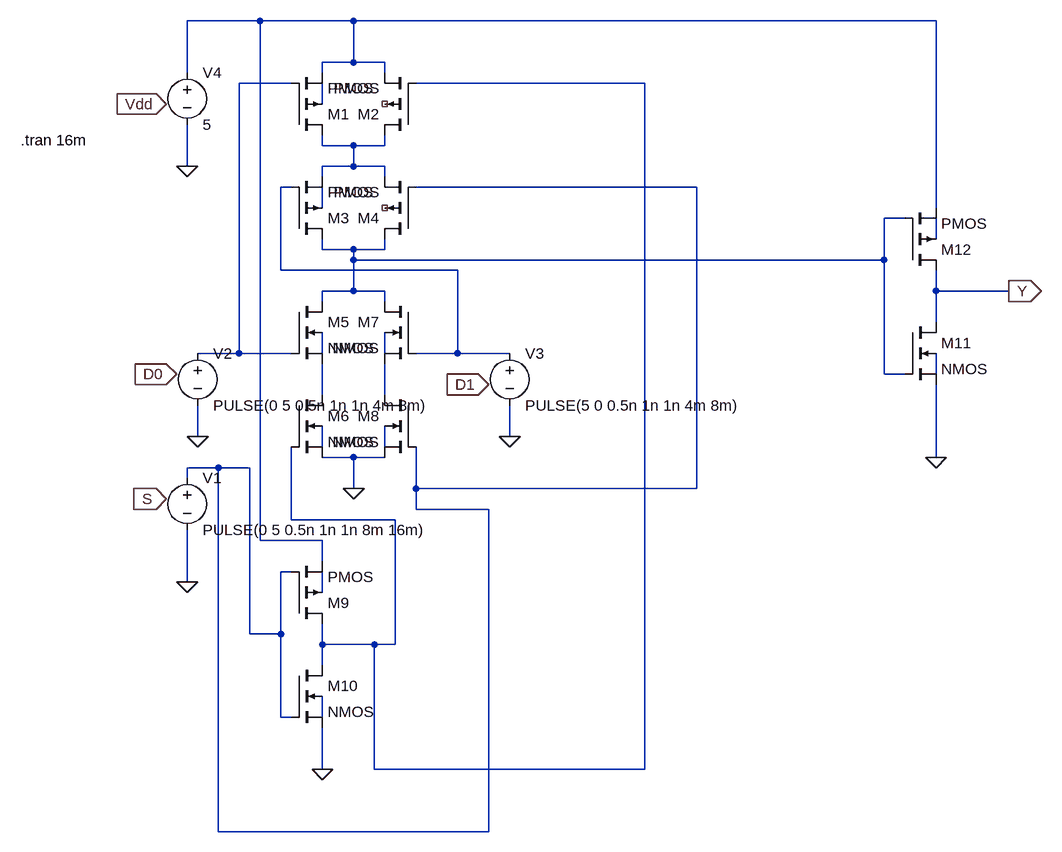
[diagram p0: schematic mux.asc]
mux.asc, the LTspice schematic file:
Version 4.1
SHEET 1 1260 1220
WIRE 32 -32 -80 -32
WIRE 176 -32 32 -32
WIRE 1072 -32 176 -32
WIRE 176 32 176 -32
WIRE 176 32 128 32
WIRE 224 32 176 32
WIRE -80 48 -80 -32
WIRE 128 48 128 32
WIRE 224 48 224 32
WIRE 80 64 0 64
WIRE 624 64 272 64
WIRE 128 96 128 64
WIRE 128 160 128 144
WIRE 176 160 128 160
WIRE 224 160 224 144
WIRE 224 160 176 160
WIRE -80 192 -80 128
WIRE 176 192 176 160
WIRE 176 192 128 192
WIRE 224 192 176 192
WIRE 128 208 128 192
WIRE 224 208 224 192
WIRE 80 224 64 224
WIRE 704 224 272 224
WIRE 128 256 128 224
WIRE 1072 256 1072 -32
WIRE 1024 272 992 272
WIRE 1072 304 1072 272
WIRE 128 320 128 304
WIRE 176 320 128 320
WIRE 224 320 224 304
WIRE 224 320 176 320
WIRE 176 336 176 320
WIRE 992 336 992 272
WIRE 992 336 176 336
WIRE 64 352 64 224
WIRE 336 352 64 352
WIRE 176 384 176 336
WIRE 176 384 128 384
WIRE 224 384 176 384
WIRE 1072 384 1072 352
WIRE 1184 384 1072 384
WIRE 128 400 128 384
WIRE 224 400 224 384
WIRE 1072 432 1072 384
WIRE 0 480 0 64
WIRE 0 480 -64 480
WIRE 80 480 0 480
WIRE 128 480 128 448
WIRE 224 480 224 448
WIRE 336 480 336 352
WIRE 336 480 272 480
WIRE 416 480 336 480
WIRE 992 512 992 336
WIRE 1024 512 992 512
WIRE 1072 512 1072 480
WIRE 128 544 128 496
WIRE 224 544 224 496
WIRE -64 608 -64 560
WIRE 416 608 416 560
WIRE 128 624 128 592
WIRE 224 624 224 592
WIRE 176 640 128 640
WIRE 224 640 176 640
WIRE 1072 640 1072 528
WIRE -32 656 -80 656
WIRE 16 656 -32 656
WIRE -80 672 -80 656
WIRE 176 688 176 640
WIRE 272 688 272 624
WIRE 704 688 704 224
WIRE 704 688 272 688
WIRE 272 720 272 688
WIRE 384 720 272 720
WIRE 80 736 80 624
WIRE 240 736 80 736
WIRE 32 768 32 -32
WIRE 128 768 32 768
WIRE 128 800 128 768
WIRE 80 816 64 816
WIRE -80 832 -80 752
WIRE 128 848 128 816
WIRE 16 912 16 656
WIRE 64 912 64 816
WIRE 64 912 16 912
WIRE 128 928 128 896
WIRE 208 928 128 928
WIRE 240 928 240 736
WIRE 240 928 208 928
WIRE 128 960 128 928
WIRE 64 1040 64 912
WIRE 80 1040 64 1040
WIRE 128 1040 128 1008
WIRE 128 1120 128 1056
WIRE 208 1120 208 928
WIRE 624 1120 624 64
WIRE 624 1120 208 1120
WIRE -32 1216 -32 656
WIRE 384 1216 384 720
WIRE 384 1216 -32 1216
FLAG 1072 640 0
FLAG 128 1120 0
FLAG -80 192 0
FLAG -64 608 0
FLAG 416 608 0
FLAG -80 832 0
FLAG 176 688 0
FLAG -112 704 S
IOPIN -112 704 In
FLAG -96 512 D0
IOPIN -96 512 In
FLAG 384 528 D1
IOPIN 384 528 In
FLAG 1184 384 Y
IOPIN 1184 384 Out
FLAG -112 96 Vdd
IOPIN -112 96 In
SYMBOL pmos4 80 144 M180
SYMATTR InstName M1
SYMBOL pmos4 272 144 R180
SYMATTR InstName M2
SYMBOL pmos4 80 304 M180
SYMATTR InstName M3
SYMBOL pmos4 272 304 R180
SYMATTR InstName M4
SYMBOL nmos4 80 400 R0
SYMATTR InstName M5
SYMBOL nmos4 80 544 R0
SYMATTR InstName M6
SYMBOL nmos4 272 400 M0
SYMATTR InstName M7
SYMBOL nmos4 272 544 M0
SYMATTR InstName M8
SYMBOL voltage -80 656 R0
WINDOW 123 0 0 Left 0
WINDOW 39 0 0 Left 0
SYMATTR InstName V1
SYMATTR Value PULSE(0 5 0.5n 1n 1n 8m 16m)
SYMBOL voltage -64 464 R0
WINDOW 123 0 0 Left 0
WINDOW 39 0 0 Left 0
SYMATTR InstName V2
SYMATTR Value PULSE(0 5 0.5n 1n 1n 4m 8m)
SYMBOL voltage 416 464 R0
WINDOW 123 0 0 Left 0
WINDOW 39 0 0 Left 0
SYMATTR InstName V3
SYMATTR Value PULSE(5 0 0.5n 1n 1n 4m 8m)
SYMBOL voltage -80 32 R0
WINDOW 123 0 0 Left 0
WINDOW 39 0 0 Left 0
SYMATTR InstName V4
SYMATTR Value 5
SYMBOL pmos4 80 896 M180
SYMATTR InstName M9
SYMBOL nmos4 80 960 R0
SYMATTR InstName M10
SYMBOL nmos4 1024 432 R0
SYMATTR InstName M11
SYMBOL pmos4 1024 352 M180
SYMATTR InstName M12
TEXT -336 152 Left 2 !.tran 16m

The netlist it stands for:
* mux.asc
M1 N005 N002 N001 N004 PMOS
M2 N005 N003 N001 NC_01 PMOS
M3 N009 N006 N005 N008 PMOS
M4 N009 N007 N005 NC_02 PMOS
M5 N009 N002 N014 N011 NMOS
M6 N014 N003 0 N016 NMOS
M7 N009 N006 N015 N012 NMOS
M8 N015 N007 0 N017 NMOS
V1 N007 0 PULSE(0 5 0.5n 1n 1n 8m 16m)
V2 N002 0 PULSE(0 5 0.5n 1n 1n 4m 8m)
V3 N006 0 PULSE(5 0 0.5n 1n 1n 4m 8m)
V4 N001 0 5
M9 N003 N007 N001 N018 PMOS
M10 N003 N007 0 N019 NMOS
M11 Y N009 0 N013 NMOS
M12 Y N009 N001 N010 PMOS
.model NMOS NMOS
.model PMOS PMOS
.lib standard.mos
.tran 16m
.backanno
.end